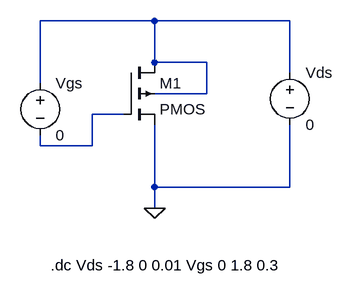
[diagram p0: schematic Draft2.asc]
Draft2.asc, the LTspice schematic file:
Version 4
SHEET 1 880 680
WIRE 224 48 48 48
WIRE 432 48 224 48
WIRE 224 112 224 48
WIRE 304 112 224 112
WIRE 224 128 224 112
WIRE 432 128 432 48
WIRE 48 144 48 48
WIRE 304 160 304 112
WIRE 304 160 224 160
WIRE 176 192 128 192
WIRE 48 240 48 224
WIRE 128 240 128 192
WIRE 128 240 48 240
WIRE 224 304 224 208
WIRE 432 304 432 208
WIRE 432 304 224 304
WIRE 224 336 224 304
FLAG 224 336 0
SYMBOL pmos4 176 112 R0
SYMATTR InstName M1
SYMBOL voltage 432 112 R0
WINDOW 123 0 0 Left 0
WINDOW 39 0 0 Left 0
SYMATTR InstName Vds
SYMATTR Value 0
SYMBOL voltage 48 128 R0
WINDOW 123 0 0 Left 0
WINDOW 39 0 0 Left 0
SYMATTR InstName Vgs
SYMATTR Value 0
TEXT 64 424 Left 2 !.dc Vds -1.8 0 0.01 Vgs 0 1.8 0.3

The netlist it stands for:
* Draft2.asc
M1 N001 N002 0 N001 PMOS
Vds N001 0 0
Vgs N001 N002 0
.model NMOS NMOS
.model PMOS PMOS
.lib standard.mos
.dc Vds -1.8 0 0.01 Vgs 0 1.8 0.3
.backanno
.end